# Altium schematic sheet Current_Sense_1.SchDoc
size A3; DocumentNumber: 6; SheetNumber: 6; SheetTotal: 10
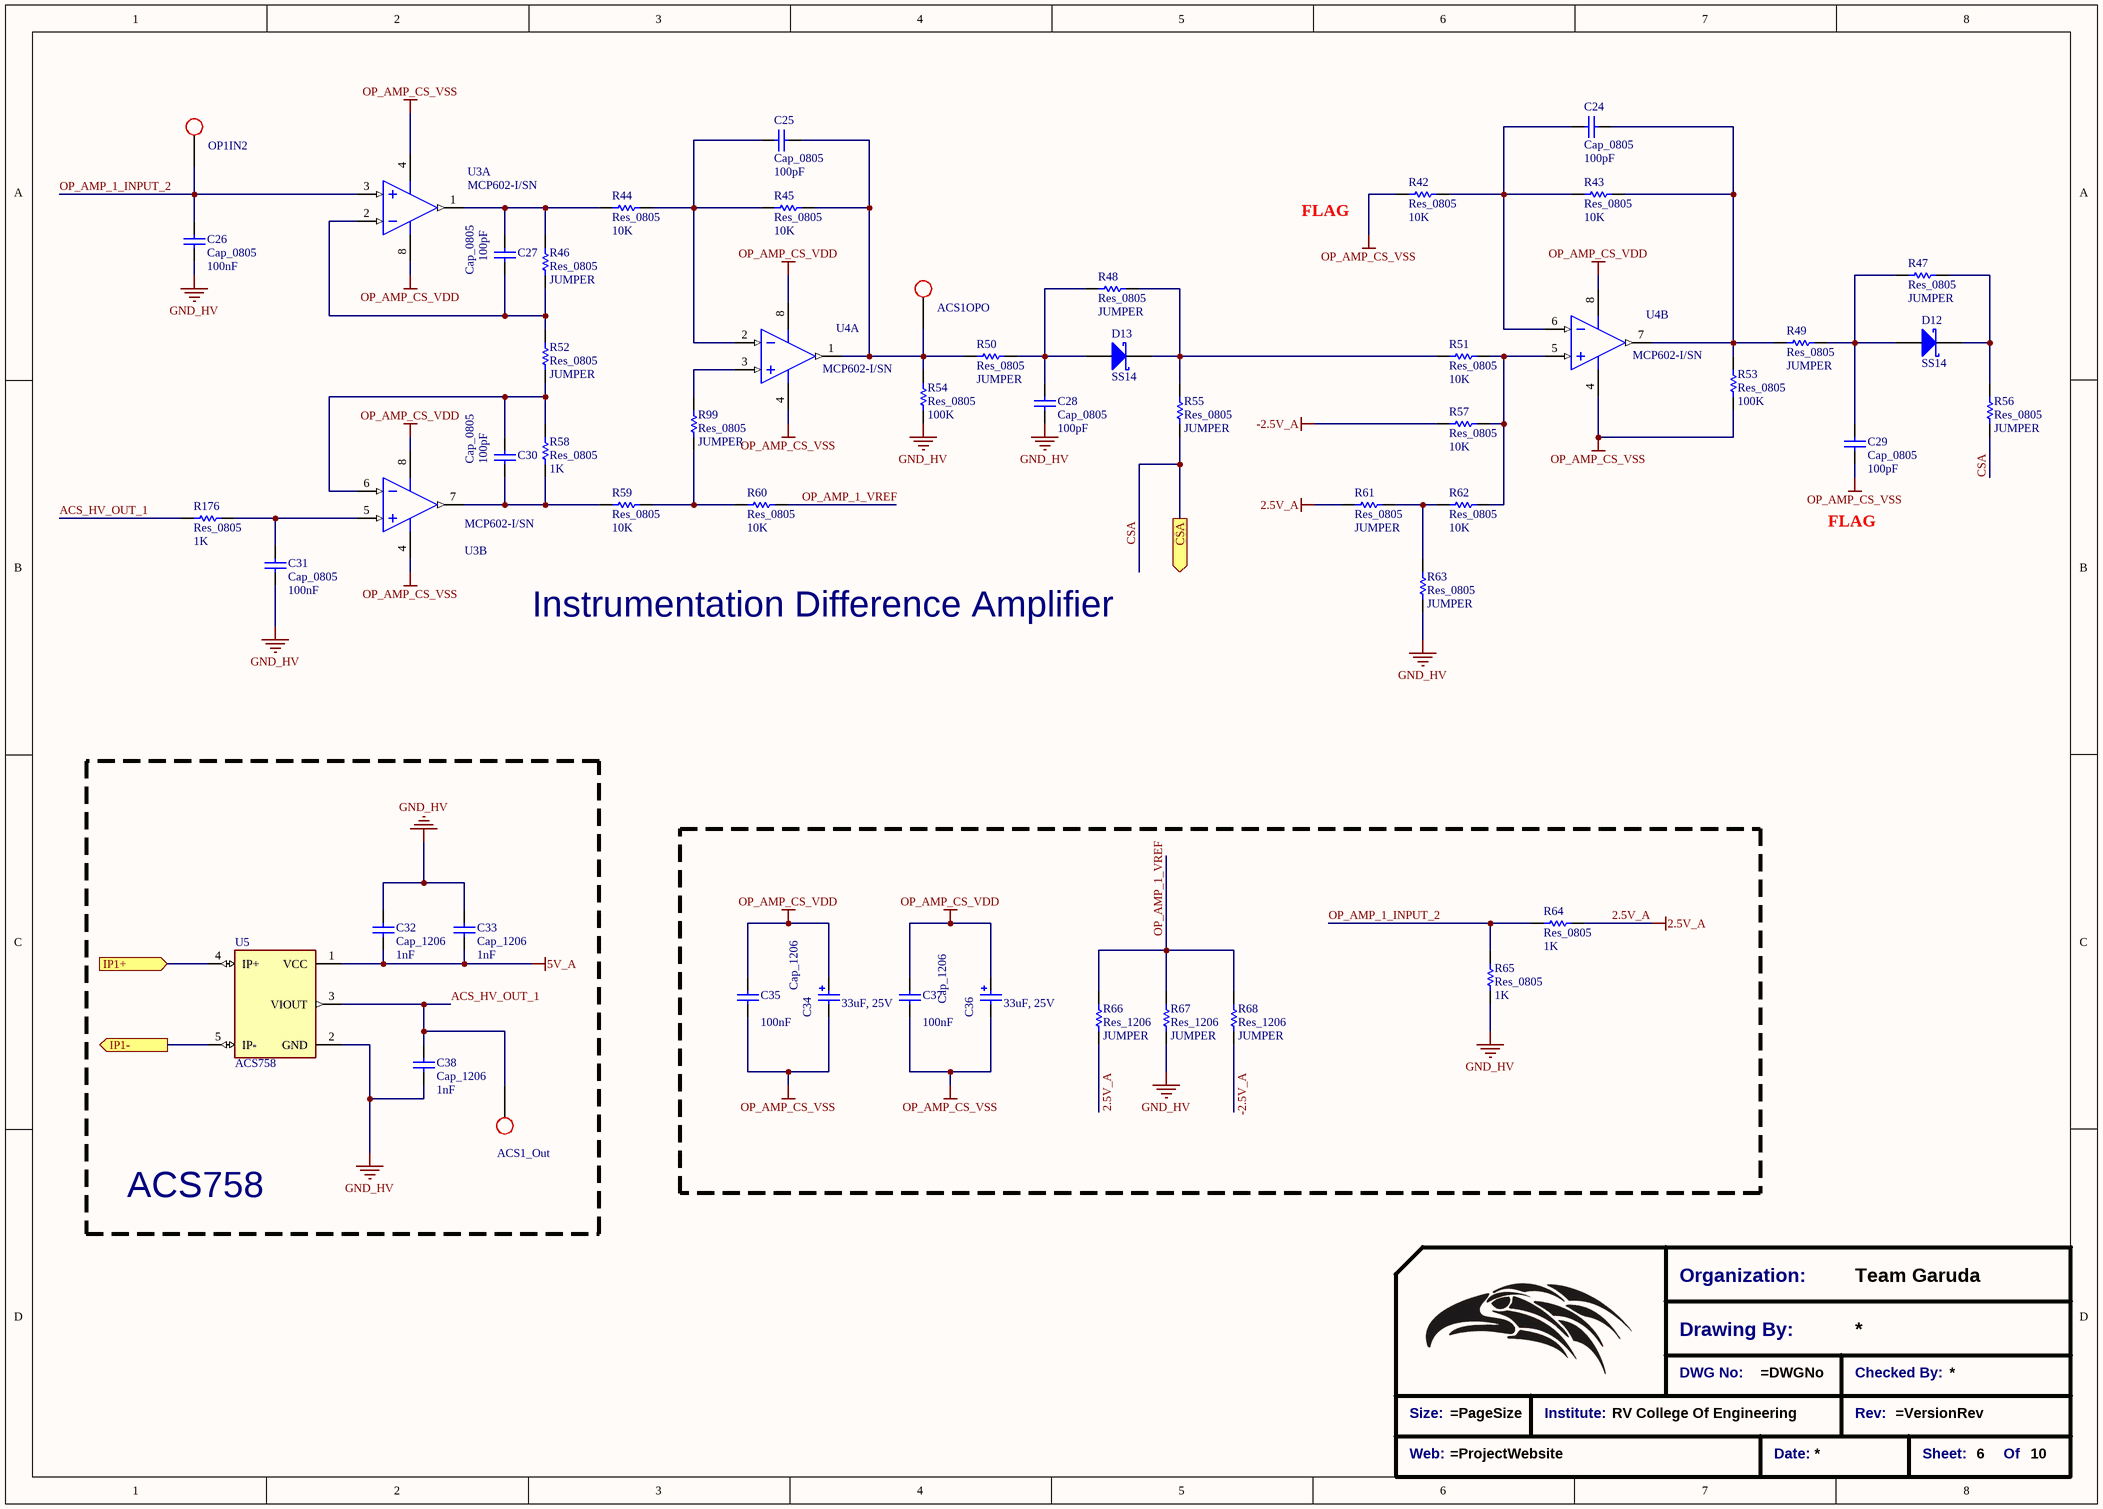
[diagram p0: Current_Sense_1.SchDoc]

## Parts
*?  Title_Block  (value not drawn)  (graphical)
ACS1_Out  Test Point  [Test_point_SMD]  (value not drawn)  (no BOM)
ACS1OPO  Test Point  [Test_point_SMD]  (value not drawn)  (no BOM)
C24  Cap_0805  value 100pF  [SMD-0805C]
C25  Cap_0805  value 100pF  [SMD-0805C]
C26  Cap_0805  value 100nF  [SMD-0805C]
C27  Cap_0805  value 100pF  [SMD-0805C]
C28  Cap_0805  value 100pF  [SMD-0805C]
C29  Cap_0805  value 100pF  [SMD-0805C]
C30  Cap_0805  value 100pF  [SMD-0805C]
C31  Cap_0805  value 100nF  [SMD-0805C]
C32  Cap_1206  value 1nF  [SMD-1206C]
C33  Cap_1206  value 1nF  [SMD-1206C]
C34  33uF, 25V  [WCAP-ASLL_6.3x5.5]
C35  Cap_1206  value 100nF  [SMD-1206C]
C36  33uF, 25V  [WCAP-ASLL_6.3x5.5]
C37  Cap_1206  value 100nF  [SMD-1206C]
C38  Cap_1206  value 1nF  [SMD-1206C]
D12  SS14  [DIOM4226X22N]
D13  SS14  [DIOM4226X22N]
OP1IN2  Test Point  [Test_point_SMD]  (value not drawn)  (no BOM)
R42  Res_0805  value 10K  [WRIS-KSKE_0805_H=0.6mm]
R43  Res_0805  value 10K  [WRIS-KSKE_0805_H=0.6mm]
R44  Res_0805  value 10K  [WRIS-KSKE_0805_H=0.6mm]
R45  Res_0805  value 10K  [WRIS-KSKE_0805_H=0.6mm]
R46  Res_0805  value JUMPER  [WRIS-KSKE_0805_H=0.6mm]
R47  Res_0805  value JUMPER  [WRIS-KSKE_0805_H=0.6mm]
R48  Res_0805  value JUMPER  [WRIS-KSKE_0805_H=0.6mm]
R49  Res_0805  value JUMPER  [WRIS-KSKE_0805_H=0.6mm]
R50  Res_0805  value JUMPER  [WRIS-KSKE_0805_H=0.6mm]
R51  Res_0805  value 10K  [WRIS-KSKE_0805_H=0.6mm]
R52  Res_0805  value JUMPER  [WRIS-KSKE_0805_H=0.6mm]
R53  Res_0805  value 100K  [WRIS-KSKE_0805_H=0.6mm]
R54  Res_0805  value 100K  [WRIS-KSKE_0805_H=0.6mm]
R55  Res_0805  value JUMPER  [WRIS-KSKE_0805_H=0.6mm]
R56  Res_0805  value JUMPER  [WRIS-KSKE_0805_H=0.6mm]
R57  Res_0805  value 10K  [WRIS-KSKE_0805_H=0.6mm]
R58  Res_0805  value 1K  [WRIS-KSKE_0805_H=0.6mm]
R59  Res_0805  value 10K  [WRIS-KSKE_0805_H=0.6mm]
R60  Res_0805  value 10K  [WRIS-KSKE_0805_H=0.6mm]
R61  Res_0805  value JUMPER  [WRIS-KSKE_0805_H=0.6mm]
R62  Res_0805  value 10K  [WRIS-KSKE_0805_H=0.6mm]
R63  Res_0805  value JUMPER  [WRIS-KSKE_0805_H=0.6mm]
R64  Res_0805  value 1K  [WRIS-KSKE_0805_H=0.6mm]
R65  Res_0805  value 1K  [WRIS-KSKE_0805_H=0.6mm]
R66  Res_1206  value JUMPER  [WRIS-KSKE_1206_H=0.6mm]
R67  Res_1206  value JUMPER  [WRIS-KSKE_1206_H=0.6mm]
R68  Res_1206  value JUMPER  [WRIS-KSKE_1206_H=0.6mm]
R99  Res_0805  value JUMPER  [WRIS-KSKE_0805_H=0.6mm]
R176  Res_0805  value 1K  [WRIS-KSKE_0805_H=0.6mm]
U3  MCP602-I/SN  [SOIC127P570X175_HS-9N - No Thermal]  (parts A,B of 2)
U4  MCP602-I/SN  [SOIC127P570X175_HS-9N - No Thermal]  (parts A,B of 2)
U5  ACS758  [XDCR_ACS758]

## Blocks framed on the sheet
ACS758: ACS1_Out C32 C33 C38 U5

## Ports
CSA (out), IP1+ (in), IP1- (out)

## Nets
2.5V_A: R61.1 R64.2 R66.1
5V_A: C32.2 C33.2 U5.1(VCC)
-2.5V_A: R57.2 R68.1
GND_HV: C26.1 C28.1 C31.1 C32.1 C33.1 C38.1 R54.2 R63.1 R65.1 R67.1 U5.2(GND)
OP_AMP_CS_VDD: C34.2(P) C35.2 C36.2(P) C37.2 U3.8(VDD) U4.8(VDD)
OP_AMP_CS_VSS: C29.1 C34.1(N) C35.1 C36.1(N) C37.1 R42.2 R53.2 U3.4(VSS) U4.4(VSS)
ACS_HV_OUT_1: ACS1_Out.1 C38.2 R176.2 U5.3(VIOUT)
CSA: R55.1 R56.1 ; port CSA
IP1+: U5.4(IP+) ; port IP1+
IP1-: U5.5(IP-) ; port IP1-
OP_AMP_1_INPUT_2: C26.2 OP1IN2.1 R64.1 R65.2 U3.3(VINA+)
OP_AMP_1_VREF: R60.1 R66.2 R67.2 R68.2
NetACS1OPO_1: ACS1OPO.1 C25.2 R45.1 R50.1 R54.1 U4.1(VOUTA)
NetC24_1: C24.1 R42.1 R43.2 U4.6(VINB-)
NetC24_2: C24.2 R43.1 R49.1 R53.1 U4.7(VOUTB)
NetC25_1: C25.1 R44.1 R45.2 U4.2(VINA-)
NetC27_1: C27.1 R46.1 R52.2 U3.2(VINA-)
NetC27_2: C27.2 R44.2 R46.2 U3.1(VOUTA)
NetC28_2: C28.2 D13.2(A) R48.1 R50.2
NetC29_2: C29.2 D12.2(A) R47.1 R49.2
NetC30_1: C30.1 R58.1 R59.2 U3.7(VOUTB)
NetC30_2: C30.2 R52.1 R58.2 U3.6(VINB-)
NetC31_2: C31.2 R176.1 U3.5(VINB+)
NetD12_1: D12.1(K) R47.2 R56.2
NetD13_1: D13.1(K) R48.2 R51.2 R55.2
NetR51_1: R51.1 R57.1 R62.1 U4.5(VINB+)
NetR59_1: R59.1 R60.2 R99.1
NetR61_2: R61.2 R62.2 R63.2
NetR99_2: R99.2 U4.3(VINA+)

## Notes on the sheet
- FLAG
- Instrumentation Difference Amplifier
- (in symbol Title_Block) Organization:; Team Garuda; Drawing By:; DWG No:; Checked By:; Size:; Institute:; RV College Of Engineering; Rev:; Web:; Date:; Sheet:; Of

## Library data of the parts
*? = Title_Block: Standard Title Block
ACS1_Out ACS1OPO OP1IN2 = Test Point: TP
C24-C33 C35 C37 C38 = Cap: Capacitor; Published: 8-Jun-2000; LatestRevisionDate: 17-Jul-2002; LatestRevisionNote: Re-released for DXP Platform.; PackageReference: RAD-0.3; Publisher: Altium Limited; PackageDescription: Radial Cap, Thru-Hole; 2 Leads; 0.3 in Pin Spacing
C34 C36 = 865060443003: WCAP-ASLL SMT Aluminum Electrolytic Capacitors, D6.3mm x L5.5mm, 33uF, +/-20%, 25VDC; Dissipation Factor: 14%; Endurance: 2000h; Leakage Current: 8.25uA; Ripple Current max.: 230mA; Technical Reference: ASED055330M025DVCTBB000; ComponentLink1Description: Manufacturer; ComponentLink1URL: http://www.we-online.de; ComponentLink2Description: Datasheet; ComponentLink2URL: https://katalog.we-online.com/pbs/datasheet/865060443003.pdf; Length: 5.5mm; Mounting Technology: SMT; Operating Temperature: -55 to +105degC; Packaging: Tape and Reel; Published Date: August 2019; Capacitance: 33uF; Diameter: 6.3mm; Part Number: 865060443003; Publisher: Wurth Elektronik; Capacitance Tolerance: +/-20%; Rated Voltage: 25VDC
D12 D13 = SS14: Schottky Rectifier, 1.1 W, -65 to 125 degC, 2-Pin SMD, RoHS, Tape and Reel; Manufacturer: Fairchild; Configuration: SINGLE; Diode Element Material: SILICON; Power Dissipation Limit-Max (W): 1.1; Additional Feature: FREEWHEELINGDIODE; Signal Diode Type: SIGNALDIODE; Number of Elements: 1; JEDEC-95 Code: DO-214AC; Rep Pk Reverse Voltage-Max (V): 40; Package Body Material: PLASTIC/EPOXY; CAGE Code: 1HBD3,07933,59621,7D893; Peak Reflow Temperature (Cel): 260; Package Shape: RECTANGULAR; Manufacturer URL: https://www.fairchildsemi.com/; JESD-97 Code: e3; Package Reference: DO-214AC-2; RoHS Compliant: YES; Package Description: 2-Pin Surface Mount Device, Body 4.375 x 2.725 mm; Technology: SCHOTTKY; Surface Mount: YES; Datasheet URL: http://www.onlinecomponents.com/datasheet/ss14.aspx?p=11369800; Terminal Form: CBEND; Package Style: SMALLOUTLINE; Number of Terminals: 2; JESD-30 Code: R-PDSO-C2; Average Forward Current-Max (A): 1; Terminal Finish: MATTETIN; Datasheet Version: Oct-13; Terminal Position: DUAL; Package URL: https://www.fairchildsemi.com/package-drawings/DO/DO214AC.pdf; Moisture Sensitivity Level: 1; Lead Free: YES
R42-R68 R99 R176 = Res1: Resistor; Published: 8-Jun-2000; LatestRevisionDate: 17-Jul-2002; LatestRevisionNote: Re-released for DXP Platform.; PackageReference: AXIAL-0.3; Publisher: Altium Limited; PackageDescription: Axial Device, Thru-Hole; 2 Leads; 0.3 in Pin Spacing
U3 U4 = MCP602_2: 2.7V to 6.0V Single Supply CMOS Operational Amplifier, 8-Pin SOIC, Industrial Temperature; ComponentLink1URL: http://www.microchip.com/; ComponentLink1Description: Manufacturer URL; RevisionNote: URLs added.; PackageReference: SOIC-SN8; ComponentLink2URL: http://ww1.microchip.com/downloads/en/DeviceDoc/21314g.pdf; ComponentLink3URL: http://www.microchip.com/stellent/groups/techpub_sg/documents/packagingspec/en012702.pdf; PackageDescription: 8-Lead Plastic Small Outline (SN) - Narrow, 3.90mm Body [SOIC]; DatasheetVersion: revG, Dec-2007; ComponentLink2Description: Datasheet; ComponentLink3Description: Package Specification; Code_IPC: SOIC127P600-8; Code_JEDEC: MS-012; PackageVersion: revBB, Aug-2009
U5 = ACS758: Current Sensor 50A 1 Channel Hall Effect, Open Loop Unidirectional 5-CB Formed Leads, PFF; MF: Allegro MicroSystems LLC; Package: 5-CB-5 Allegro MicroSystems LLC; MP: ACS758; Availability: Unavailable; Price: None; Value: *; SnapEDA_Link: https://www.snapeda.com/parts/ACS758/Allegro%20MicroSystems%20LLC/view-part/226237/?ref=snap